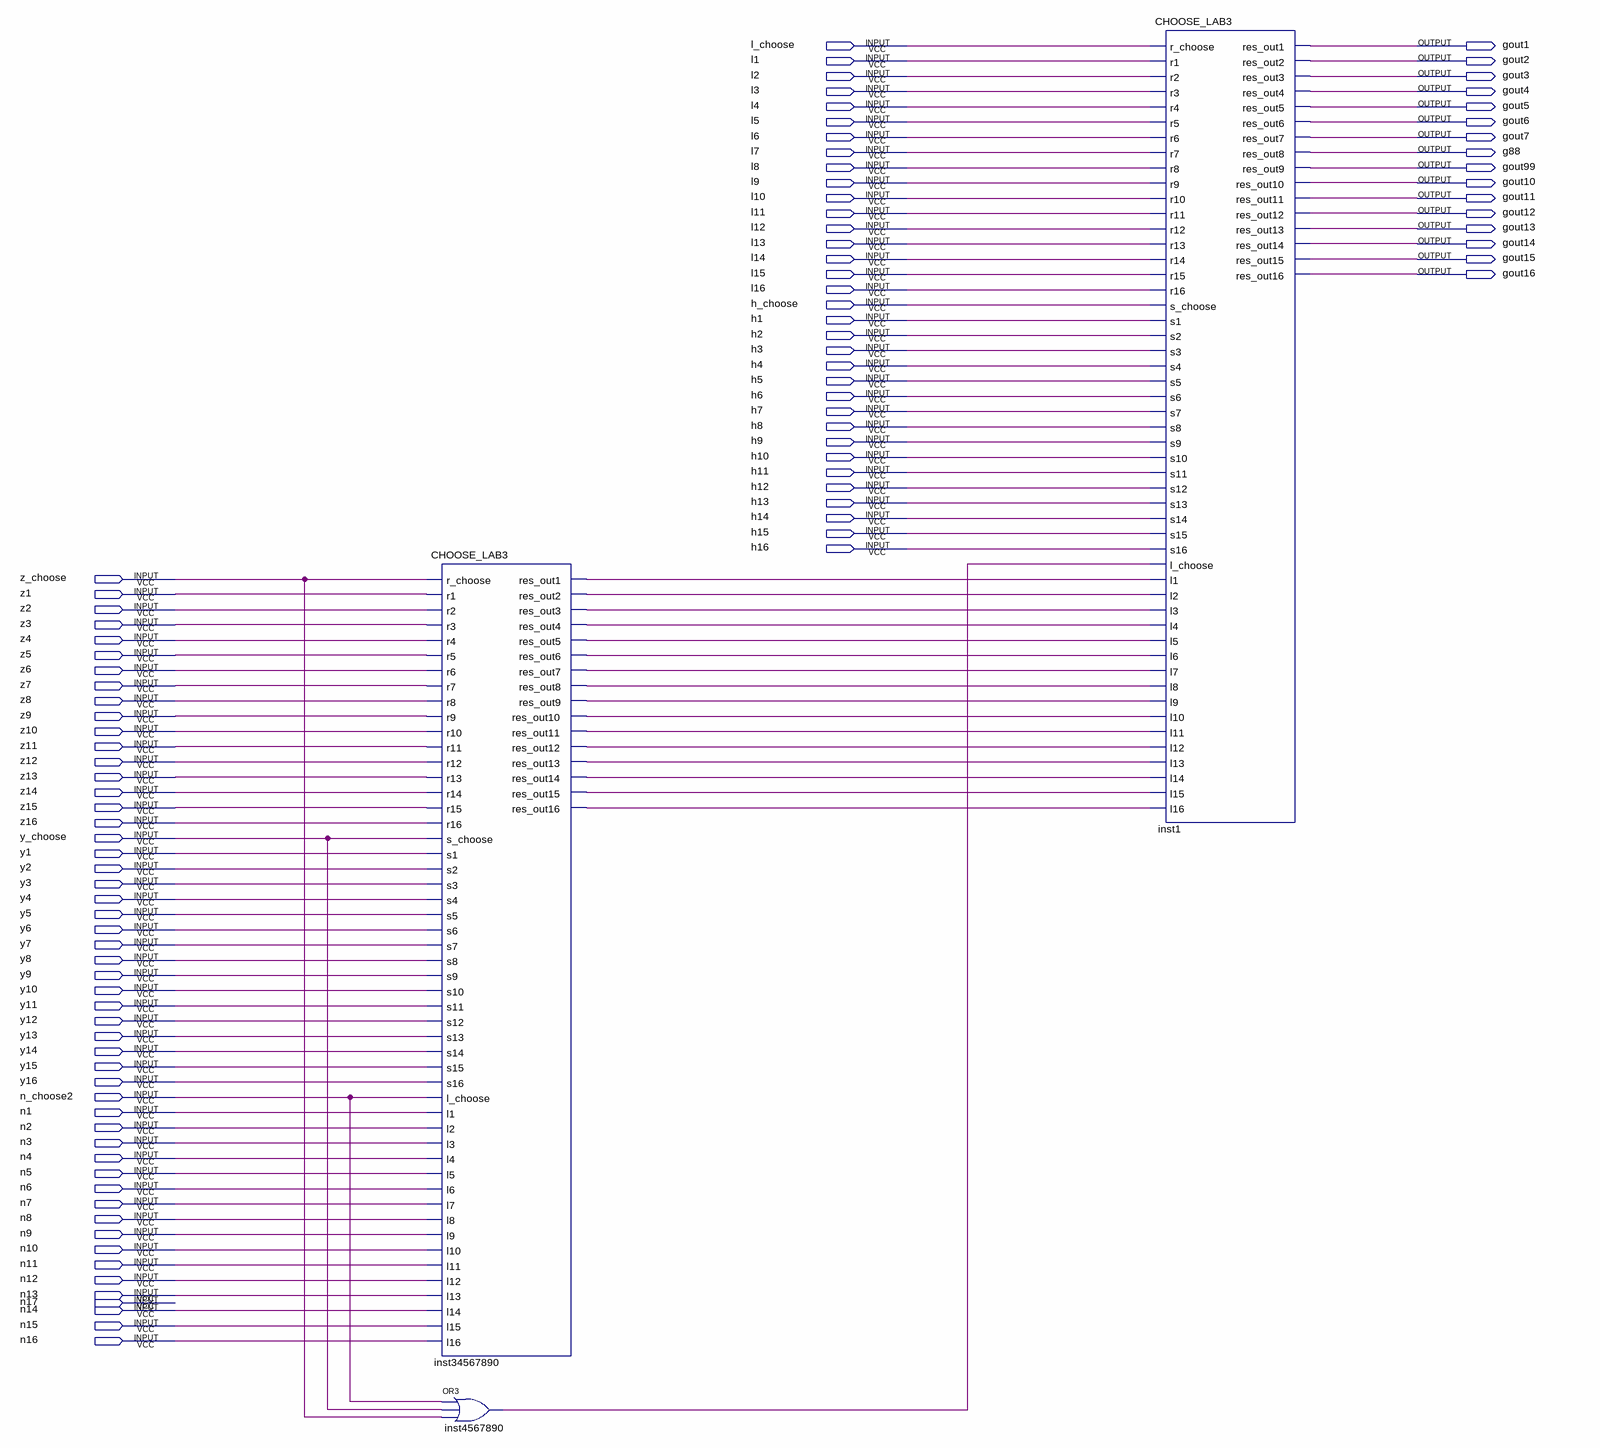
[diagram p0: schematic sheet]
// Quartus schematic select6.bdf as structural Verilog: 3 symbols, 102 pins
module select6 (
  input  l_choose,
  input  l1,
  input  l2,
  input  l3,
  input  l4,
  input  l5,
  input  l6,
  input  l7,
  input  l8,
  input  l9,
  input  l10,
  input  l11,
  input  l12,
  input  l13,
  input  l14,
  input  l15,
  input  l16,
  input  h_choose,
  input  h1,
  input  h2,
  input  h3,
  input  h4,
  input  h5,
  input  h6,
  input  h7,
  input  h8,
  input  h9,
  input  h10,
  input  h11,
  input  h12,
  input  h13,
  input  h14,
  input  h15,
  input  h16,
  input  z_choose,
  input  z1,
  input  z2,
  input  z3,
  input  z4,
  input  z5,
  input  z6,
  input  z7,
  input  z8,
  input  z9,
  input  z10,
  input  z11,
  input  z12,
  input  z13,
  input  z14,
  input  z15,
  input  z16,
  input  y_choose,
  input  y1,
  input  y2,
  input  y3,
  input  y4,
  input  y5,
  input  y6,
  input  y7,
  input  y8,
  input  y9,
  input  y10,
  input  y11,
  input  y12,
  input  y13,
  input  y14,
  input  y15,
  input  y16,
  input  n_choose2,
  input  n1,
  input  n2,
  input  n3,
  input  n4,
  input  n5,
  input  n6,
  input  n7,
  input  n8,
  input  n9,
  input  n10,
  input  n11,
  input  n12,
  input  n13,
  input  n17,
  input  n14,
  input  n15,
  input  n16,
  output gout1,
  output gout2,
  output gout3,
  output gout4,
  output gout5,
  output gout6,
  output gout7,
  output g88,
  output gout99,
  output gout10,
  output gout11,
  output gout12,
  output gout13,
  output gout14,
  output gout15,
  output gout16
);

  wire inst4567890_out, inst34567890_res_out1, inst34567890_res_out2, inst34567890_res_out3,
       inst34567890_res_out4, inst34567890_res_out5, inst34567890_res_out6, inst34567890_res_out7,
       inst34567890_res_out8, inst34567890_res_out9, inst34567890_res_out10, inst34567890_res_out11,
       inst34567890_res_out12, inst34567890_res_out13, inst34567890_res_out14, inst34567890_res_out15,
       inst34567890_res_out16;

  CHOOSE_LAB3 inst34567890 (
    .r_choose(z_choose), .r1(z1), .r2(z2), .r3(z3), .r4(z4), .r5(z5), .r6(z6), .r7(z7), .r8(z8), .r9(z9),
    .r10(z10), .r11(z11), .r12(z12), .r13(z13), .r14(z14), .r15(z15), .r16(z16), .s_choose(y_choose),
    .s1(y1), .s2(y2), .s3(y3), .s4(y4), .s5(y5), .s6(y6), .s7(y7), .s8(y8), .s9(y9), .s10(y10), .s11(y11),
    .s12(y12), .s13(y13), .s14(y14), .s15(y15), .s16(y16), .l_choose(n_choose2), .l1(n1), .l2(n2), .l3(n3),
    .l4(n4), .l5(n5), .l6(n6), .l7(n7), .l8(n8), .l9(n9), .l10(n10), .l11(n11), .l12(n12), .l13(n13),
    .l14(n14), .l15(n15), .l16(n16), .res_out1(inst34567890_res_out1), .res_out2(inst34567890_res_out2),
    .res_out3(inst34567890_res_out3), .res_out4(inst34567890_res_out4), .res_out5(inst34567890_res_out5),
    .res_out6(inst34567890_res_out6), .res_out7(inst34567890_res_out7), .res_out8(inst34567890_res_out8),
    .res_out9(inst34567890_res_out9), .res_out10(inst34567890_res_out10), .res_out11(inst34567890_res_out11),
    .res_out12(inst34567890_res_out12), .res_out13(inst34567890_res_out13),
    .res_out14(inst34567890_res_out14), .res_out15(inst34567890_res_out15), .res_out16(inst34567890_res_out16));
  or inst4567890 (inst4567890_out, n_choose2, y_choose, z_choose);
  CHOOSE_LAB3 inst1 (
    .r_choose(l_choose), .r1(l1), .r2(l2), .r3(l3), .r4(l4), .r5(l5), .r6(l6), .r7(l7), .r8(l8), .r9(l9),
    .r10(l10), .r11(l11), .r12(l12), .r13(l13), .r14(l14), .r15(l15), .r16(l16), .s_choose(h_choose),
    .s1(h1), .s2(h2), .s3(h3), .s4(h4), .s5(h5), .s6(h6), .s7(h7), .s8(h8), .s9(h9), .s10(h10), .s11(h11),
    .s12(h12), .s13(h13), .s14(h14), .s15(h15), .s16(h16), .l_choose(inst4567890_out),
    .l1(inst34567890_res_out1), .l2(inst34567890_res_out2), .l3(inst34567890_res_out3),
    .l4(inst34567890_res_out4), .l5(inst34567890_res_out5), .l6(inst34567890_res_out6),
    .l7(inst34567890_res_out7), .l8(inst34567890_res_out8), .l9(inst34567890_res_out9),
    .l10(inst34567890_res_out10), .l11(inst34567890_res_out11), .l12(inst34567890_res_out12),
    .l13(inst34567890_res_out13), .l14(inst34567890_res_out14), .l15(inst34567890_res_out15),
    .l16(inst34567890_res_out16), .res_out1(gout1), .res_out2(gout2), .res_out3(gout3), .res_out4(gout4),
    .res_out5(gout5), .res_out6(gout6), .res_out7(gout7), .res_out8(g88), .res_out9(gout99),
    .res_out10(gout10), .res_out11(gout11), .res_out12(gout12), .res_out13(gout13), .res_out14(gout14),
    .res_out15(gout15), .res_out16(gout16));
endmodule
